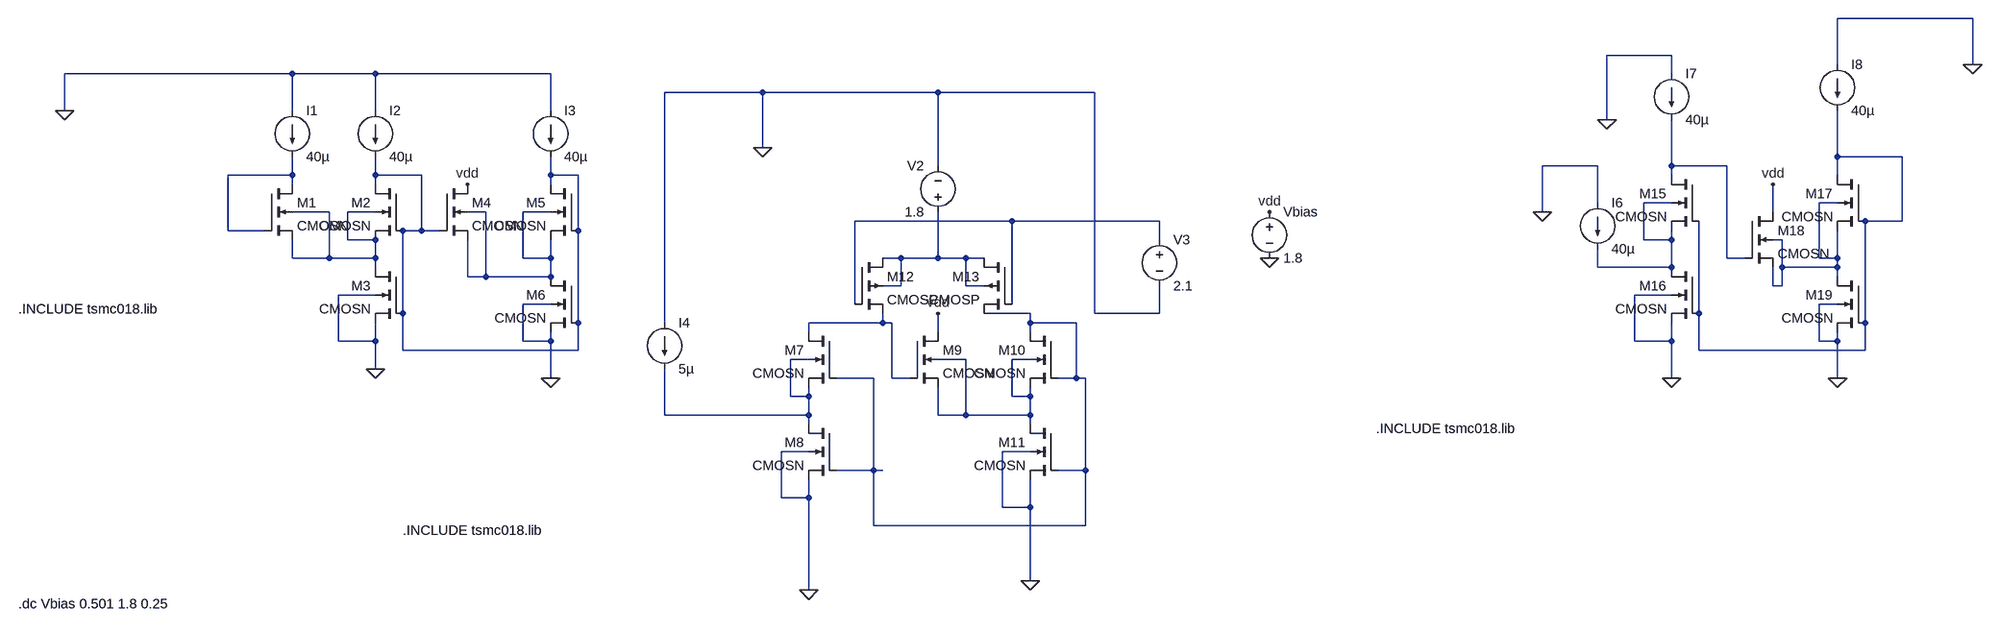
[diagram p0: schematic impedance_testbench.asc]
impedance_testbench.asc, the LTspice schematic file:
Version 4
SHEET 1 3908 888
WIRE 3888 -144 3632 -144
WIRE 3344 -80 3232 -80
WIRE 3632 -64 3632 -144
WIRE 3888 -64 3888 -144
WIRE 400 -48 0 -48
WIRE 544 -48 400 -48
WIRE 848 -48 544 -48
WIRE 3344 -48 3344 -80
WIRE 1376 -16 1184 -16
WIRE 1680 -16 1376 -16
WIRE 1952 -16 1680 -16
WIRE 0 16 0 -48
WIRE 400 16 400 -48
WIRE 544 16 544 -48
WIRE 848 16 848 -48
WIRE 3232 32 3232 -80
WIRE 1376 80 1376 -16
WIRE 3632 96 3632 16
WIRE 3744 96 3632 96
WIRE 1680 112 1680 -16
WIRE 3216 112 3120 112
WIRE 3344 112 3344 32
WIRE 3440 112 3344 112
WIRE 400 128 400 96
WIRE 400 128 288 128
WIRE 544 128 544 96
WIRE 624 128 544 128
WIRE 848 128 848 96
WIRE 896 128 848 128
WIRE 3344 128 3344 112
WIRE 3632 128 3632 96
WIRE 400 144 400 128
WIRE 544 144 544 128
WIRE 848 144 848 128
WIRE 3216 176 3216 112
WIRE 3344 176 3296 176
WIRE 3632 176 3600 176
WIRE 464 192 400 192
WIRE 544 192 496 192
WIRE 736 192 704 192
WIRE 848 192 800 192
WIRE 3120 192 3120 112
WIRE 3520 192 3520 144
WIRE 1808 208 1536 208
WIRE 2064 208 1808 208
WIRE 3744 208 3744 96
WIRE 3744 208 3680 208
WIRE 288 224 288 128
WIRE 352 224 288 224
WIRE 624 224 624 128
WIRE 624 224 592 224
WIRE 656 224 624 224
WIRE 896 224 896 128
WIRE 496 240 496 192
WIRE 544 240 496 240
WIRE 2064 240 2064 208
WIRE 3296 240 3296 176
WIRE 3344 240 3344 224
WIRE 3344 240 3296 240
WIRE 3536 240 3520 240
WIRE 400 272 400 240
WIRE 464 272 464 192
WIRE 464 272 400 272
WIRE 544 272 544 240
WIRE 544 272 464 272
WIRE 800 272 800 192
WIRE 848 272 848 240
WIRE 848 272 800 272
WIRE 1616 272 1584 272
WIRE 1680 272 1680 192
WIRE 1680 272 1616 272
WIRE 1728 272 1680 272
WIRE 1760 272 1728 272
WIRE 3440 272 3440 112
WIRE 3472 272 3440 272
WIRE 3600 272 3600 176
WIRE 3632 272 3632 224
WIRE 3632 272 3600 272
WIRE 544 288 544 272
WIRE 3216 288 3216 256
WIRE 3344 288 3344 240
WIRE 3344 288 3216 288
WIRE 3536 288 3536 240
WIRE 3632 288 3632 272
WIRE 3632 288 3536 288
WIRE 704 304 704 240
WIRE 736 304 736 192
WIRE 736 304 704 304
WIRE 848 304 848 272
WIRE 848 304 736 304
WIRE 3632 304 3632 288
WIRE 1616 320 1616 272
WIRE 1616 320 1584 320
WIRE 1728 320 1728 272
WIRE 1760 320 1728 320
WIRE 3520 320 3520 288
WIRE 3536 320 3536 288
WIRE 3536 320 3520 320
WIRE 544 336 480 336
WIRE 3344 336 3280 336
WIRE 848 352 800 352
WIRE 1536 352 1536 208
WIRE 1808 352 1808 208
WIRE 3632 352 3600 352
WIRE 592 368 592 224
WIRE 1840 368 1760 368
WIRE 1952 368 1952 -16
WIRE 2064 368 2064 320
WIRE 2064 368 1952 368
WIRE 3392 368 3392 208
WIRE 896 384 896 224
WIRE 1184 384 1184 -16
WIRE 1584 384 1584 368
WIRE 1584 384 1456 384
WIRE 1600 384 1584 384
WIRE 1840 384 1840 368
WIRE 1920 384 1840 384
WIRE 3680 384 3680 208
WIRE 1456 400 1456 384
WIRE 1680 400 1680 368
WIRE 1840 400 1840 384
WIRE 480 416 480 336
WIRE 544 416 544 384
WIRE 544 416 480 416
WIRE 800 416 800 352
WIRE 848 416 848 400
WIRE 848 416 800 416
WIRE 3280 416 3280 336
WIRE 3344 416 3344 384
WIRE 3344 416 3280 416
WIRE 3600 416 3600 352
WIRE 3632 416 3632 400
WIRE 3632 416 3600 416
WIRE 592 432 592 368
WIRE 896 432 896 384
WIRE 896 432 592 432
WIRE 3392 432 3392 368
WIRE 3680 432 3680 384
WIRE 3680 432 3392 432
WIRE 1456 448 1424 448
WIRE 1728 448 1680 448
WIRE 1840 448 1808 448
WIRE 544 464 544 416
WIRE 848 480 848 416
WIRE 1568 480 1504 480
WIRE 1600 480 1600 384
WIRE 1632 480 1600 480
WIRE 1920 480 1920 384
WIRE 1920 480 1888 480
WIRE 1936 480 1920 480
WIRE 3344 480 3344 416
WIRE 3632 480 3632 416
WIRE 1424 512 1424 448
WIRE 1456 512 1456 496
WIRE 1456 512 1424 512
WIRE 1808 512 1808 448
WIRE 1840 512 1840 496
WIRE 1840 512 1808 512
WIRE 1184 544 1184 464
WIRE 1456 544 1456 512
WIRE 1456 544 1184 544
WIRE 1680 544 1680 496
WIRE 1728 544 1728 448
WIRE 1728 544 1680 544
WIRE 1840 544 1840 512
WIRE 1840 544 1728 544
WIRE 1456 560 1456 544
WIRE 1840 560 1840 544
WIRE 1456 608 1408 608
WIRE 1840 608 1792 608
WIRE 1568 640 1568 480
WIRE 1568 640 1504 640
WIRE 1584 640 1568 640
WIRE 1936 640 1936 480
WIRE 1936 640 1888 640
WIRE 1408 688 1408 608
WIRE 1456 688 1456 656
WIRE 1456 688 1408 688
WIRE 1792 704 1792 608
WIRE 1840 704 1840 656
WIRE 1840 704 1792 704
WIRE 1568 736 1568 640
WIRE 1936 736 1936 640
WIRE 1936 736 1568 736
WIRE 1840 832 1840 704
WIRE 1456 848 1456 688
FLAG 544 464 0
FLAG 848 480 0
FLAG 0 16 0
FLAG 1840 832 0
FLAG 1456 848 0
FLAG 1680 368 vdd
FLAG 704 144 vdd
FLAG 1376 80 0
FLAG 2480 272 0
FLAG 2480 192 vdd
FLAG 3120 192 0
FLAG 3232 32 0
FLAG 3344 480 0
FLAG 3632 480 0
FLAG 3888 -64 0
FLAG 3520 144 vdd
SYMBOL cmosn 352 144 R0
SYMATTR InstName M1
SYMATTR Value2 l=180nm w=360nm
SYMBOL cmosn 592 144 M0
SYMATTR InstName M2
SYMATTR Value2 l=180nm w=360nm
SYMBOL cmosn 592 288 M0
SYMATTR InstName M3
SYMATTR Value2 l=180nm w=360nm
SYMBOL cmosn 656 144 R0
SYMATTR InstName M4
SYMATTR Value2 l=180nm w=360nm
SYMBOL cmosn 896 144 M0
SYMATTR InstName M5
SYMATTR Value2 l=180nm w=360nm
SYMBOL cmosn 896 304 M0
SYMATTR InstName M6
SYMATTR Value2 l=180nm w=360nm
SYMBOL current 400 16 R0
WINDOW 123 0 0 Left 0
WINDOW 39 0 0 Left 0
SYMATTR InstName I1
SYMATTR Value 40µ
SYMBOL current 544 16 R0
WINDOW 123 0 0 Left 0
WINDOW 39 0 0 Left 0
SYMATTR InstName I2
SYMATTR Value 40µ
SYMBOL current 848 16 R0
WINDOW 123 0 0 Left 0
WINDOW 39 0 0 Left 0
SYMATTR InstName I3
SYMATTR Value 40µ
SYMBOL cmosn 1504 400 M0
SYMATTR InstName M7
SYMATTR Value2 l=360nm w=204nm
SYMBOL cmosn 1504 560 M0
SYMATTR InstName M8
SYMATTR Value2 l=360nm w=568nm
SYMBOL cmosn 1632 400 R0
SYMATTR InstName M9
SYMATTR Value2 l=360nm w=364nm
SYMBOL cmosn 1888 400 M0
SYMATTR InstName M10
SYMATTR Value2 l=360nm w=204nm
SYMBOL cmosn 1888 560 M0
SYMATTR InstName M11
SYMATTR Value2 l=360nm w=568nm
SYMBOL cmosp 1536 272 R0
SYMATTR InstName M12
SYMATTR Value2 l=360nm w=403nm
SYMBOL cmosp 1808 272 M0
SYMATTR InstName M13
SYMATTR Value2 l=360nm w=403nm
SYMBOL voltage 1680 208 R180
WINDOW 0 24 96 Left 2
WINDOW 3 24 16 Left 2
WINDOW 123 0 0 Left 0
WINDOW 39 0 0 Left 0
SYMATTR InstName V2
SYMATTR Value 1.8
SYMBOL voltage 2064 224 R0
WINDOW 123 0 0 Left 0
WINDOW 39 0 0 Left 0
SYMATTR InstName V3
SYMATTR Value 2.1
SYMBOL current 1184 384 R0
WINDOW 123 0 0 Left 0
WINDOW 39 0 0 Left 0
SYMATTR InstName I4
SYMATTR Value 5µ
SYMBOL voltage 2480 176 R0
WINDOW 123 0 0 Left 0
WINDOW 39 0 0 Left 0
SYMATTR InstName Vbias
SYMATTR Value 1.8
SYMBOL cmosn 3392 128 M0
SYMATTR InstName M15
SYMATTR Value2 l=180nm w=360nm
SYMBOL cmosn 3392 288 M0
SYMATTR InstName M16
SYMATTR Value2 l=180nm w=360nm
SYMBOL cmosn 3680 128 M0
SYMATTR InstName M17
SYMATTR Value2 l=180nm w=360nm
SYMBOL cmosn 3472 192 R0
SYMATTR InstName M18
SYMATTR Value2 l=180nm w=360nm
SYMBOL current 3216 176 R0
WINDOW 123 0 0 Left 0
WINDOW 39 0 0 Left 0
SYMATTR InstName I6
SYMATTR Value 40µ
SYMBOL current 3344 -48 R0
WINDOW 123 0 0 Left 0
WINDOW 39 0 0 Left 0
SYMATTR InstName I7
SYMATTR Value 40µ
SYMBOL current 3632 -64 R0
WINDOW 123 0 0 Left 0
WINDOW 39 0 0 Left 0
SYMATTR InstName I8
SYMATTR Value 40µ
SYMBOL cmosn 3680 304 M0
SYMATTR InstName M19
SYMATTR Value2 l=180nm w=360nm
TEXT -80 360 Left 2 !.INCLUDE tsmc018.lib
TEXT 592 744 Left 2 !.INCLUDE tsmc018.lib
TEXT 2832 568 Left 2 !.INCLUDE tsmc018.lib
TEXT -80 872 Left 2 !.dc Vbias 0.501 1.8 0.25

The netlist it stands for:
* impedance_testbench.asc
M1 N003 N003 N007 N007 CMOSN l=180nm w=360nm
M2 N004 N004 N007 N007 CMOSN l=180nm w=360nm
M3 N007 N004 0 0 CMOSN l=180nm w=360nm
M4 vdd N004 N008 N008 CMOSN l=180nm w=360nm
M5 N004 N004 N008 N008 CMOSN l=180nm w=360nm
M6 N008 N004 0 0 CMOSN l=180nm w=360nm
I1 0 N003 40µ
I2 0 N004 40µ
I3 0 N004 40µ
M7 N012 N011 N013 N013 CMOSN l=360nm w=204nm
M8 N013 N011 0 0 CMOSN l=360nm w=568nm
M9 vdd N012 N014 N014 CMOSN l=360nm w=364nm
M10 N011 N011 N014 N014 CMOSN l=360nm w=204nm
M11 N014 N011 0 0 CMOSN l=360nm w=568nm
M12 N010 N009 N012 N010 CMOSP l=360nm w=403nm
M13 N010 N009 N011 N010 CMOSP l=360nm w=403nm
V2 N010 0 1.8
V3 N009 0 2.1
I4 0 N013 5µ
Vbias vdd 0 1.8
M15 N002 N001 N005 N005 CMOSN l=180nm w=360nm
M16 N005 N001 0 0 CMOSN l=180nm w=360nm
M17 N001 N001 N006 N006 CMOSN l=180nm w=360nm
M18 vdd N002 N006 N006 CMOSN l=180nm w=360nm
I6 0 N005 40µ
I7 0 N002 40µ
I8 0 N001 40µ
M19 N006 N001 0 0 CMOSN l=180nm w=360nm
.model NMOS NMOS
.model PMOS PMOS
.lib standard.mos
.INCLUDE tsmc018.lib
.INCLUDE tsmc018.lib
.INCLUDE tsmc018.lib
.dc Vbias 0.501 1.8 0.25
.backanno
.end